# EAGLE design StartBase (EAGLE 8.6.3)
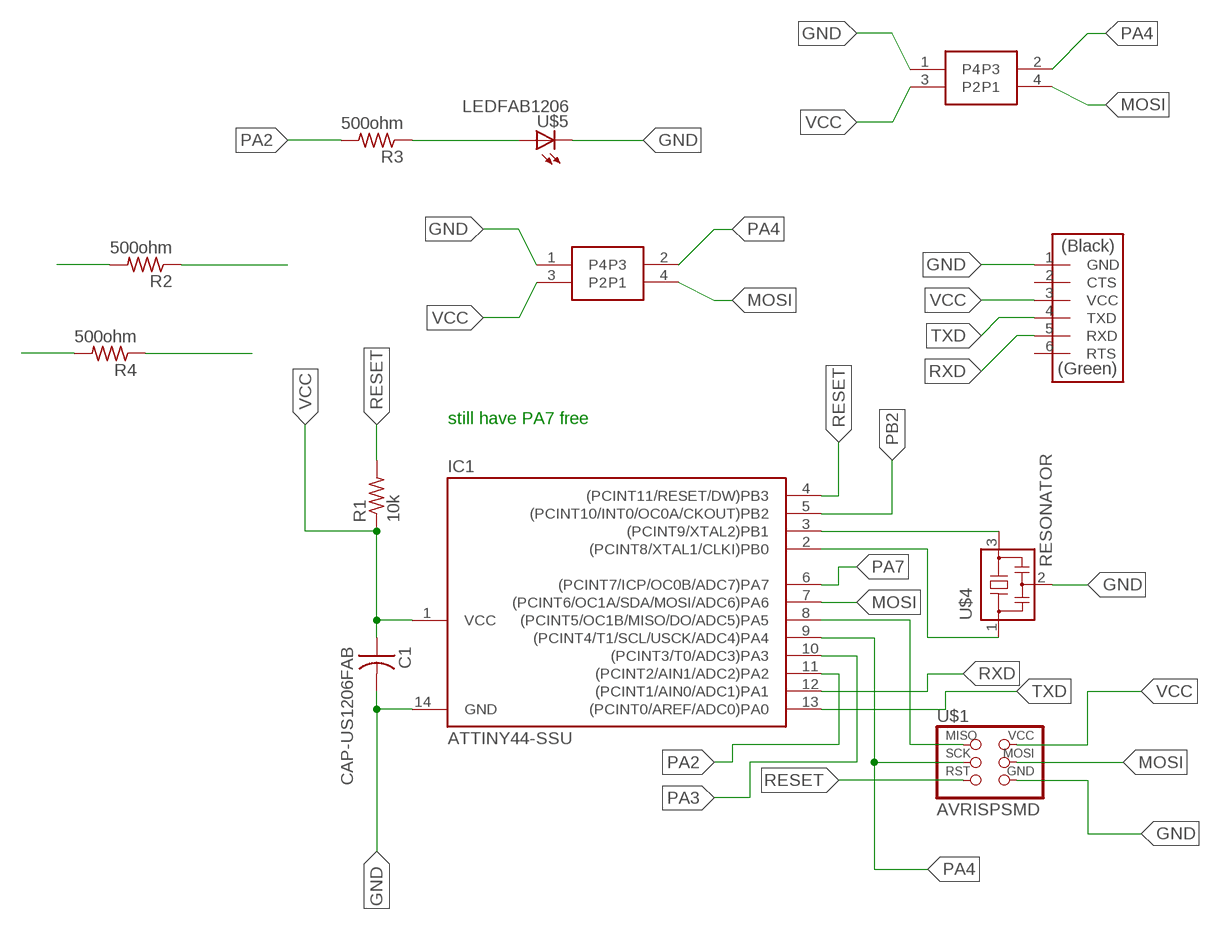
[diagram p0: schematic, sheet 1]

## Parts
C1  CAP-US1206FAB  [C1206FAB]
IC1  ATTINY44-SSU  [SOIC14]
R1  10k  RES-US1206FAB  [R1206FAB]
R2  500ohm  RES-US1206FAB  [R1206FAB]
R3  500ohm  RES-US1206FAB  [R1206FAB]
R4  500ohm  RES-US1206FAB  [R1206FAB]
U$1  AVRISPSMD  [2X03SMD]
U$2  FTDI-SMD-HEADER  [1X06SMD]
U$3  4PIN-SMD-CONNECTOR  [2X02SMD]
U$4  RESONATOR  [EFOBM]
U$5  LEDFAB1206  [LED1206FAB]
U$6  4PIN-SMD-CONNECTOR  [2X02SMD]

## Nets
GND: C1.2 IC1.14(GND) U$1.6(GND) U$2.1(GND) U$3.1(P4) U$4.2 U$5.2(C) U$6.1(P4)
MOSI: IC1.7((PCINT6/OC1A/SDA/MOSI/ADC6)PA6) U$1.4(MOSI) U$3.4(P1) U$6.4(P1)
N$1: R2.1
N$2: IC1.3((PCINT9/XTAL2)PB1) U$4.3
N$3: IC1.2((PCINT8/XTAL1/CLKI)PB0) U$4.1
N$4: R4.1
N$6: IC1.8((PCINT5/OC1B/MISO/DO/ADC5)PA5) U$1.1(MISO)
N$7: R3.1 U$5.1(A)
PA1: R2.2
PA2: IC1.11((PCINT2/AIN1/ADC2)PA2) R3.2
PA3: IC1.10((PCINT3/T0/ADC3)PA3)
PA4: IC1.9((PCINT4/T1/SCL/USCK/ADC4)PA4) U$1.3(SCK) U$3.2(P3) U$6.2(P3)
PA5: R4.2
PA7: IC1.6((PCINT7/ICP/OC0B/ADC7)PA7)
PB2: IC1.5((PCINT10/INT0/OC0A/CKOUT)PB2)
RESET: IC1.4((PCINT11/RESET/DW)PB3) R1.2 U$1.5(RST)
RXD: IC1.12((PCINT1/AIN0/ADC1)PA1) U$2.5(RXD)
TXD: IC1.13((PCINT0/AREF/ADC0)PA0) U$2.4(TXD)
VCC: C1.1 IC1.1(VCC) R1.1 U$1.2(VCC) U$2.3(VCC) U$3.3(P2) U$6.3(P2)
Unconnected: U$2.2(CTS) U$2.6(RTS)

## Notes on the sheet
- still have PA7 free

## Library data of the parts
C1 = fab:CAP-US
IC1 = fab:ATTINY44
R1-R4 = fab:RES-US: Resistor (US Symbol) Variants with postfix FAB are widened to allow the routing of internal traces
U$1 = fab:AVRISP
U$2 = fab:FTDI-SMD-HEADER
U$3 U$6 = fab:4PIN-SMD-CONNECTOR
U$4 = fab:RESONATOR
U$5 = fab:LED: LED

## Board
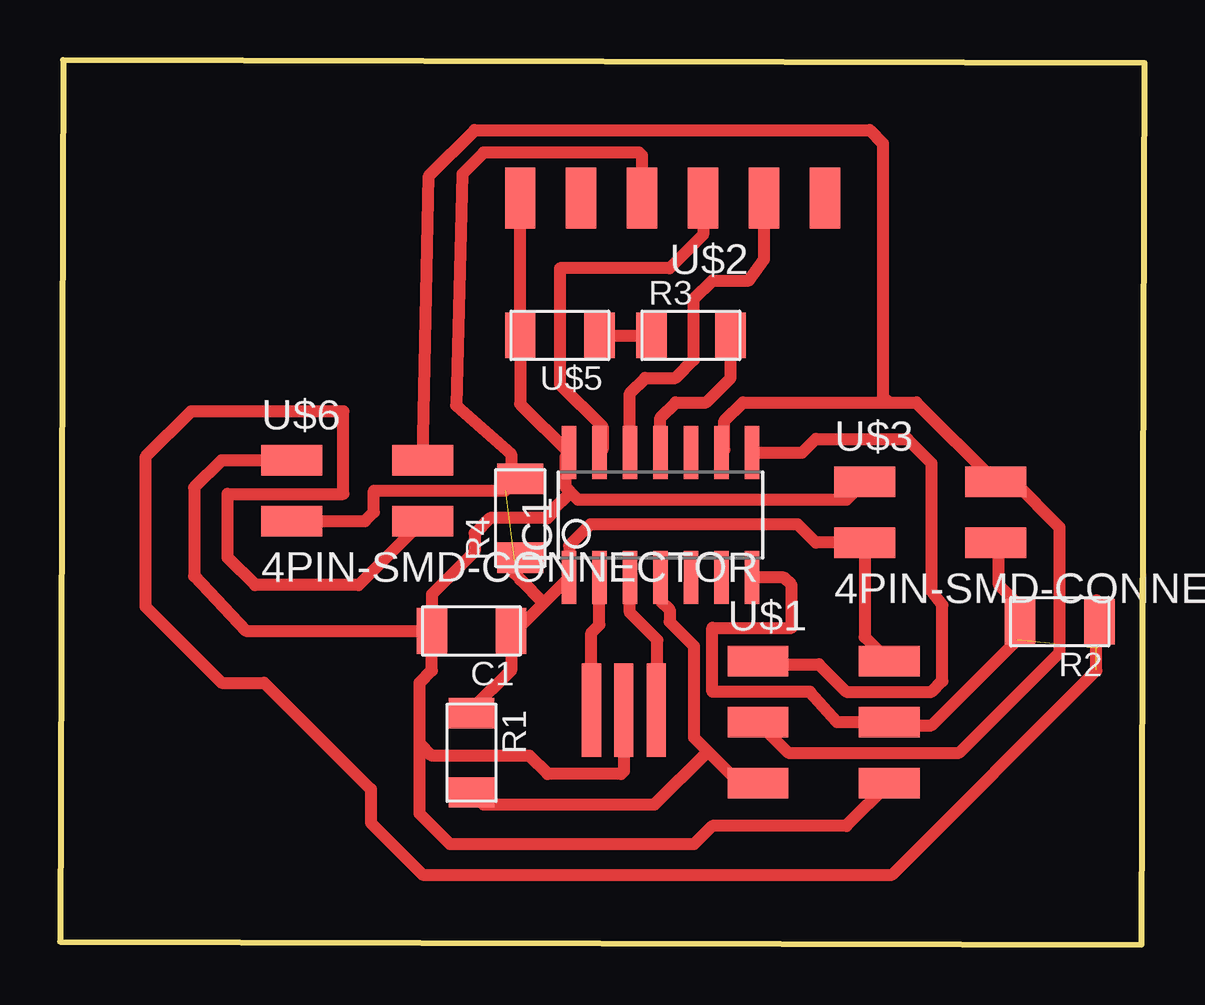
[diagram p1: board, top side]

Size 45.19 x 36.88 mm. Coordinates in mm from the lower left corner, seen from the top.
Outline: 0,0.13 45.06,0 45.19,36.75 0.13,36.88 0,0.13
Copper layers (1*16): Top 0.035mm / dielectric 1.5mm / Bottom 0.035mm
Design rules "default": minimum track width 6mil, minimum drill 0.35mm, track to track 6mil, track to pad 6mil, pad to pad 6mil, via to via 6mil, smd to smd 6mil, copper to edge 40mil, drill to drill 6mil, minimum pad ring 10mil, minimum via ring 8mil, stop-mask expansion 4mil, vias tented up to drill 0mil, thermal gap 10mil

### Footprints (pad centres in the part's own frame; a part is rotated, then mirrored left to right if it is on the bottom)
C1206FAB = smd 1.27 x 1.905: 1 -1.651,0; 2 1.651,0
SOIC14 = smd 0.61 x 2.21: 1 -3.81,-2.603; 2 -2.54,-2.603; 3 -1.27,-2.603; 4 0,-2.603; 5 1.27,-2.603; 6 2.54,-2.603; 7 3.81,-2.603; 8 3.81,2.603; 9 2.54,2.603; 10 1.27,2.603; 11 0,2.603; 12 -1.27,2.603; 13 -2.54,2.603; 14 -3.81,2.603
R1206FAB = smd 1.27 x 1.905: 1 -1.651,0; 2 1.651,0
2X03SMD = smd 2.54 x 1.27: 1 -2.54,2.54; 2 2.92,2.54; 3 -2.54,0; 4 2.92,0; 5 -2.54,-2.54; 6 2.92,-2.54
1X06SMD = smd 2.54 x 1.27: 1 0,6.35; 2 0,3.81; 3 0,1.27; 4 0,-1.27; 5 0,-3.81; 6 0,-6.35
2X02SMD = smd 2.54 x 1.27: 1 -2.54,1.27; 2 2.92,1.27; 3 -2.54,-1.27; 4 2.92,-1.27
EFOBM = smd 0.8 x 3.9: 1 -1.35,0; 2 0,0; 3 1.35,0
LED1206FAB = smd 1.27 x 1.905: 1 -1.651,0; 2 1.651,0

### Placement (x,y rotation side)
C1  17.14,13.08 180 top
IC1  25.02,17.91 0 top
R1  17.14,8 270 top
R2  41.66,13.46 180 top
R3  26.29,25.4 0 top
R4  19.18,17.78 90 top
U$1  31.62,9.27 0 top
U$2  25.53,31.11 90 top
U$3  36.07,18.03 0 top
U$4  23.5,9.78 0 top
U$5  20.83,25.4 180 top
U$6  12.19,18.92 0 top

### Tracks (layer width: path | path; a pad name or v marks a point on that pad's centre or on a via)
GND
  Top 0.508: U$2.1 U$5.2 19.18,22.54 IC1.14 21.08,20.38 21.08,19.05 21.21,18.92 | U$4.2 23.5,7.24 23.37,7.11 20.32,7.11 19.56,7.87 15.49,7.87 14.99,8.38 | C1.2 15.49,11.43 14.99,10.92 14.99,8.38 | U$3.1 32.77,18.54 21.59,18.54 21.27,18.86 | 21.27,18.86 21.21,18.92 | U$1.6 32.77,4.95 27.18,4.95 26.42,4.19 16.26,4.19 14.99,5.46 14.99,8.38 | U$6.1 6.73,20.19 5.59,19.05 5.59,15.37 7.75,13.08 C1.2 | C1.2 15.49,14.61 17.27,16.38 17.27,17.14 17.91,17.78 20.32,17.78 20.45,17.91 20.45,18.03 21.27,18.86 | 21.21,18.8 21.21,18.92
MOSI  (3 unrouted)
  Top 0.508: U$3.4 39.12,16.64 39.12,14.99 39.88,14.22 39.88,12.7 36.32,9.14 34.67,9.14 U$1.4 32.38,9.27 31.24,10.54 27.18,10.54 27.18,13.21 30.48,13.21 30.48,14.99 30.16,15.3 IC1.7 | U$6.4 12.45,14.99 8.13,14.99 6.99,16.13 6.99,18.8 11.81,18.8 11.81,22.22 5.46,22.22 3.56,20.32 3.56,14.1 6.73,10.92 8.51,10.92 12.95,6.48 12.95,5.08 15.11,2.92 34.67,2.92 43.18,11.43 43.18,14.35
N$2
  Top 0.508: U$4.3 24.89,9.83 24.89,12.7 23.75,13.84 IC1.3
N$3
  Top 0.508: U$4.1 22.14,13 22.48,13.34 IC1.2
N$6
  Top 0.508: IC1.8 30.92,20.51 31.5,21.08 35.31,21.08 36.32,20.07 36.32,14.73 36.77,14.16 36.77,10.99 36.32,10.54 32.77,10.54 31.62,11.68 29.21,11.68 U$1.1
N$7
  Top 0.508: U$5.1 R3.1
PA2
  Top 0.508: IC1.11 25.02,21.97 25.65,22.61 26.92,22.61 27.94,23.62 R3.2
PA4
  Top 0.508: IC1.9 27.69,20.64 27.69,21.84 28.45,22.61 34.54,22.61 | 34.54,22.61 35.69,22.61 U$3.2 39.75,19.3 41.66,17.4 41.66,12.19 37.47,8 30.35,8 U$1.3 | U$6.2 15.37,32.05 17.27,33.96 33.73,33.96 34.29,33.4 34.29,22.86 34.54,22.61
RESET
  Top 0.508: IC1.4 25.02,14.35 25.4,13.97 25.4,13.46 26.42,12.45 26.42,8.64 27.05,8 | 27.05,8 28.45,6.6 28.96,6.6 U$1.5 | R1.2 17.65,5.84 24.77,5.84 26.92,8 27.05,8
RXD
  Top 0.508: IC1.12 23.75,22.99 24.38,23.62 25.65,23.62 26.42,24.38 26.42,26.92 27.18,27.69 28.7,27.69 29.34,28.57 U$2.5
TXD
  Top 0.508: U$2.4 26.8,29.59 25.4,28.19 20.83,28.19 20.83,23.37 22.61,21.59 22.61,20.64 IC1.13
VCC  (1 unrouted)
  Top 0.508: 20.16,14.26 IC1.1 21.21,16.64 22.1,17.53 30.73,17.53 31.5,16.76 U$3.3 33.53,12.83 U$1.2 | 20.16,14.26 18.99,13.08 C1.1 18.8,11.43 17.14,9.78 R1.1 | U$2.3 24.26,32.89 24.13,33.02 17.65,33.02 16.76,32.13 16.51,22.48 18.8,20.45 18.8,19.18 18.54,18.92 13.08,18.92 13.08,18.03 12.7,17.65 U$6.3 | 20.16,14.26 19.2,15.21 | 19.2,15.21 19.18,15.21 | 19.2,15.21 18.92,15.49 18.92,16